# EAGLE design shield_final (EAGLE 9.6.2)
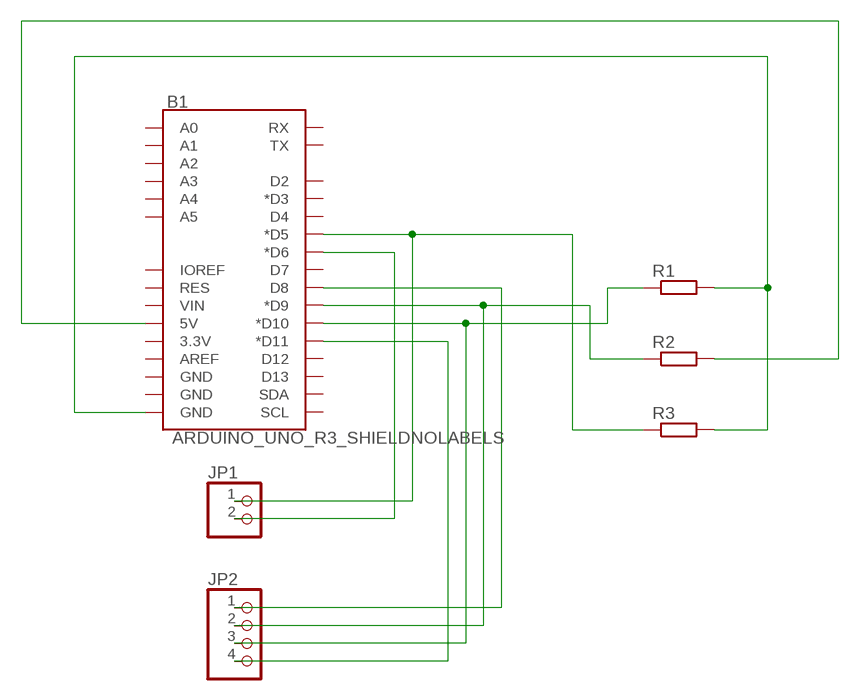
[diagram p0: schematic, sheet 1]

## Parts
B1  ARDUINO_UNO_R3_SHIELDNOLABELS  [UNO_R3_SHIELD_NOLABELS]
JP1  PINHD-1X2  [1X02]
JP2  PINHD-1X4  [1X04]
R1  R-EU_0207/10  [0207/10]
R2  R-EU_0207/10  [0207/10]
R3  R-EU_0207/10  [0207/10]

## Nets
N$1: B1.D8 JP2.1
N$2: B1.D9(*D9) JP2.2 R2.1
N$3: B1.D10(*D10) JP2.3 R1.1
N$4: B1.D11(*D11) JP2.4
N$5: B1.D5(*D5) JP1.1 R3.1
N$6: B1.D6(*D6) JP1.2
N$7: B1.GND@0(GND) R1.2 R3.2
N$8: B1.5V R2.2
Unconnected: B1.3.3V B1.A0 B1.A1 B1.A2 B1.A3 B1.A4 B1.A5 B1.AREF B1.D2 B1.D3(*D3) B1.D4 B1.D7 B1.D12 B1.D13 B1.GND@1(GND) B1.GND@2(GND) B1.IOREF B1.RES B1.RX B1.SCL B1.SDA B1.TX B1.VIN

## Library data of the parts
B1 = SparkFun-Boards:ARDUINO_UNO_R3_SHIELD: Arduino R3 Shield Footprint Shield form compatible with the Arduino Uno R3. SparkFun Products: MG2639 Cellular Shield <https://www.sparkfun.com/products/13120> MIDI Shield <https://www.sparkfun.com/products/12898> R3 Stackable Headers Kit <https://www.sparkfun.com/products/11417>
JP1 = pinhead:PINHD-1X2: PIN HEADER
JP2 = pinhead:PINHD-1X4: PIN HEADER
R1-R3 = rcl:R-EU_: RESISTOR, European symbol; SPICEPREFIX: R

## Board
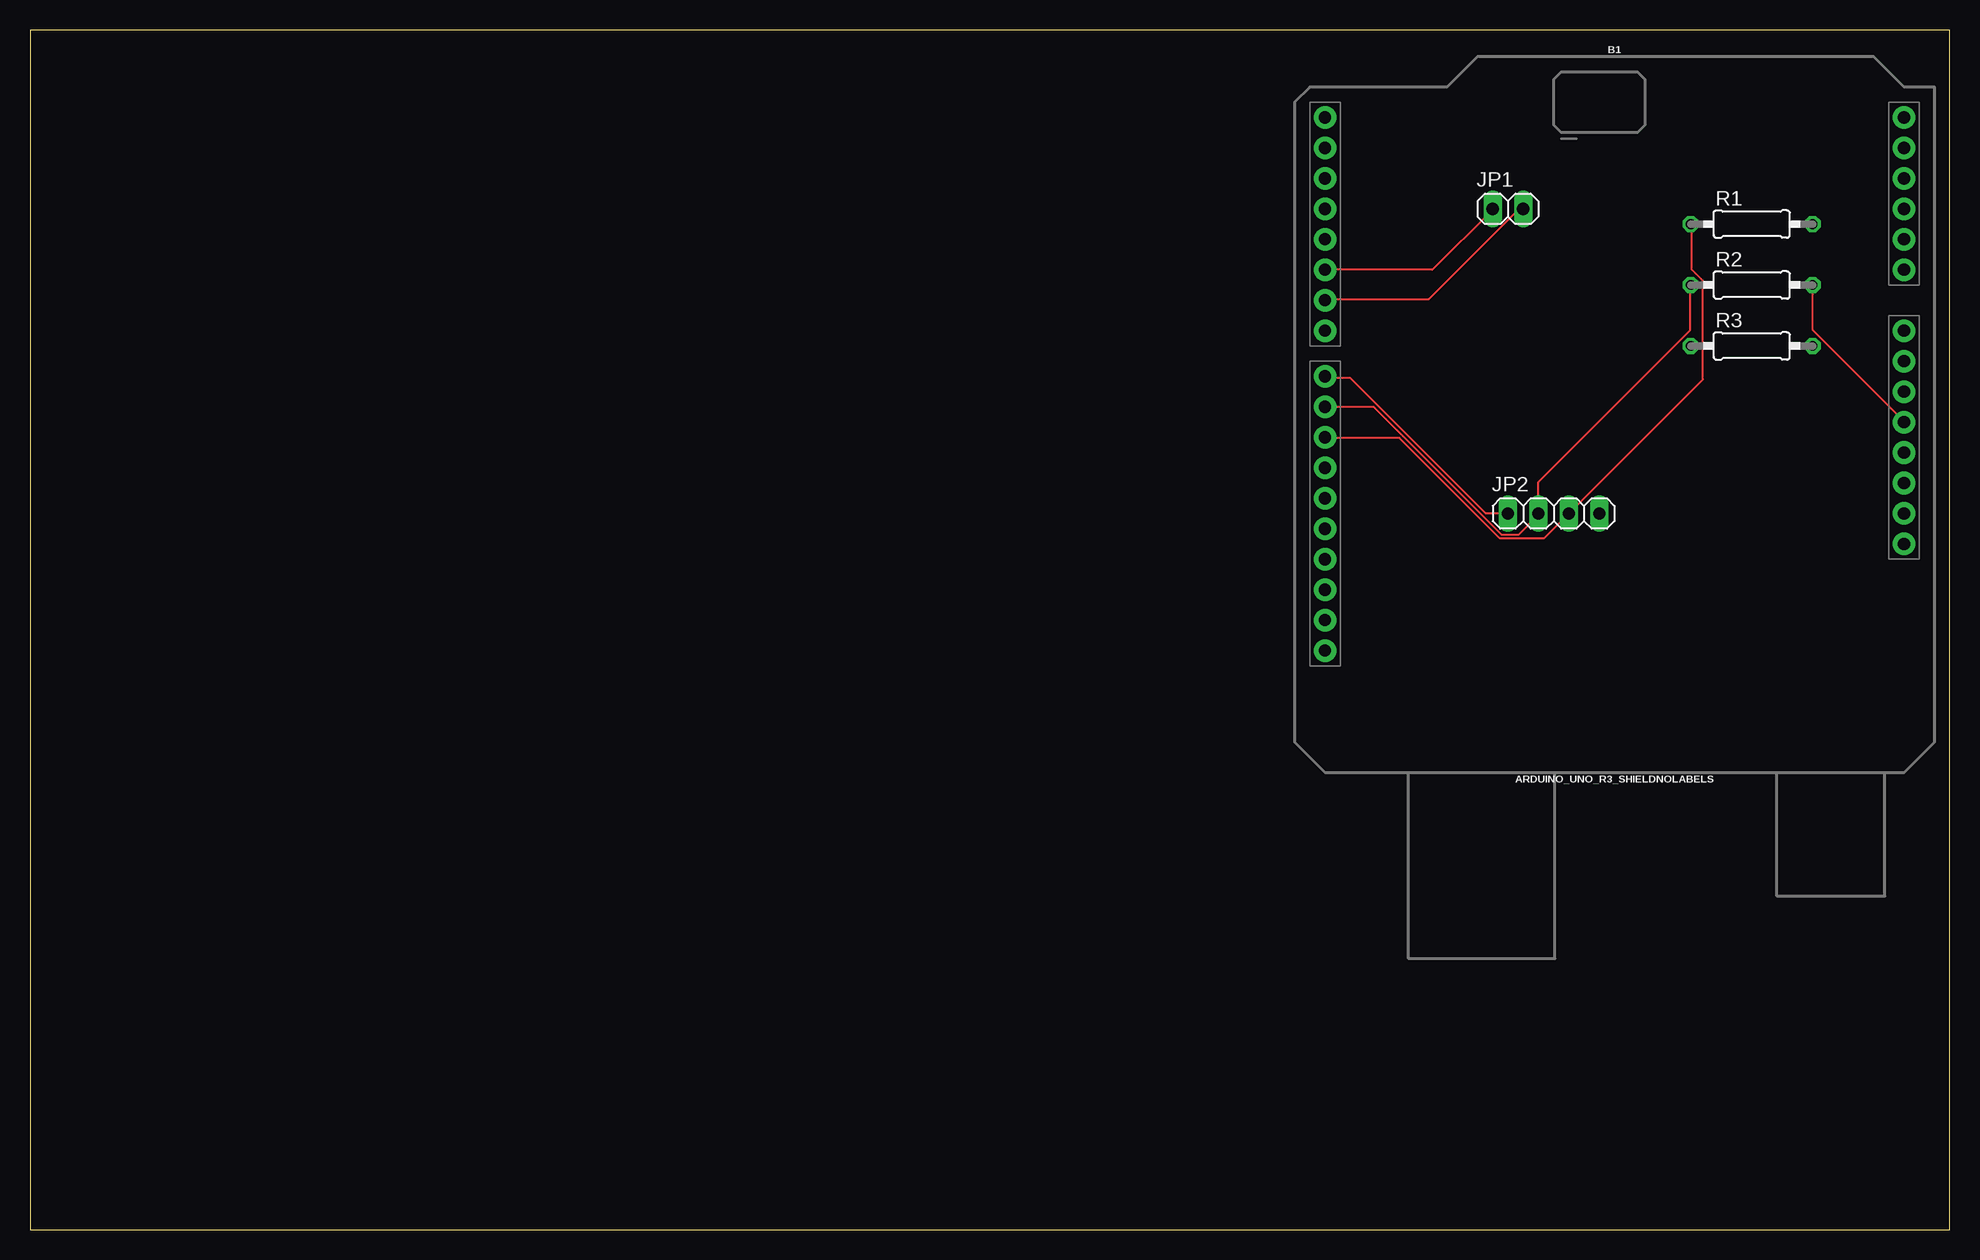
[diagram p1: board, top side]
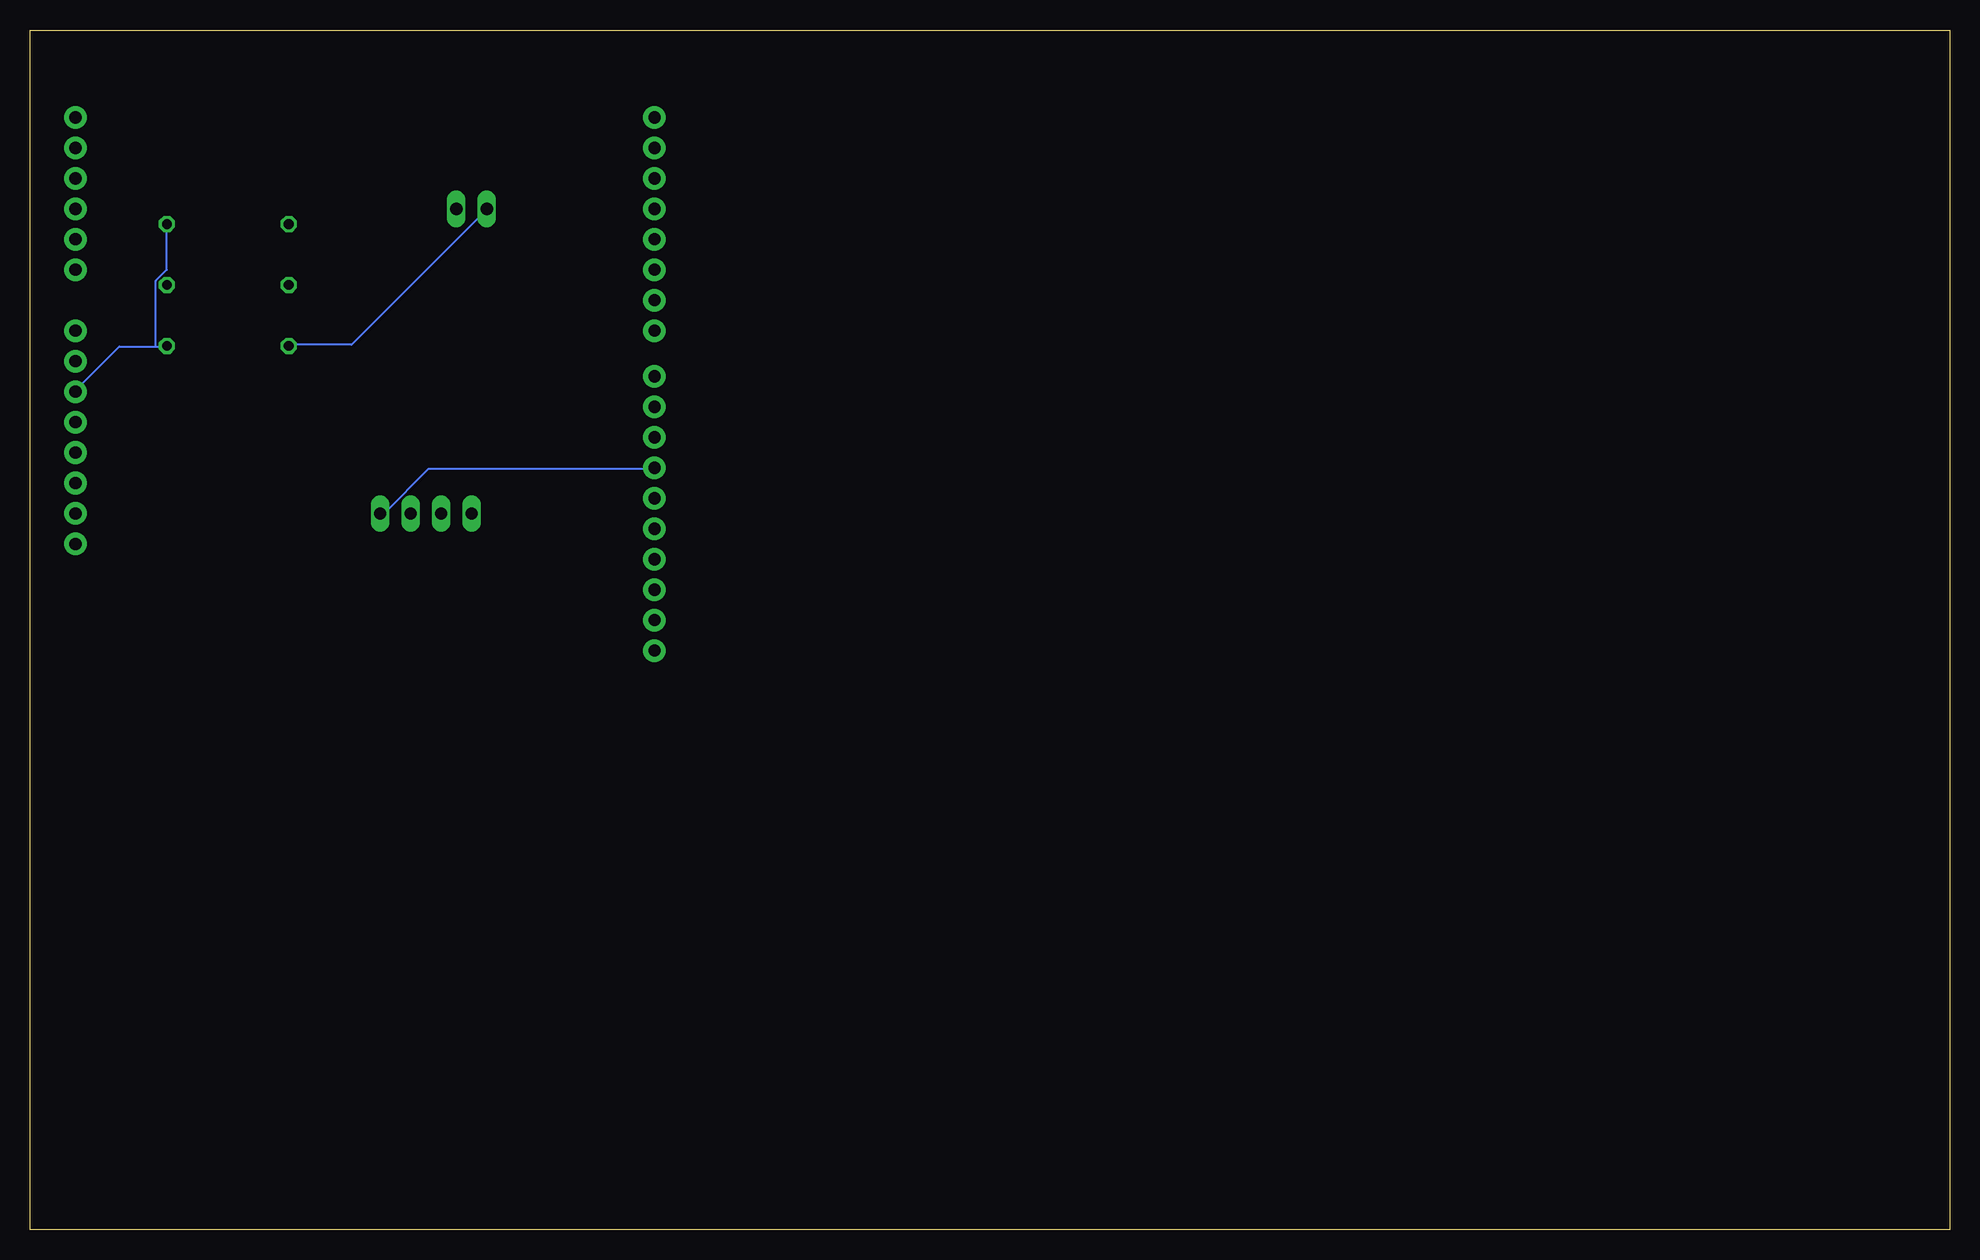
[diagram p2: board, bottom side, seen from below]

Size 160 x 100 mm. Coordinates in mm from the lower left corner, seen from the top.
Outline: 0,0 160,0 160,100 0,100 0,0
Copper layers (1*16): Top 0.035mm / dielectric 1.5mm / Bottom 0.035mm
Design rules "default": minimum track width 6mil, minimum drill 0.35mm, track to track 6mil, track to pad 6mil, pad to pad 6mil, via to via 6mil, smd to smd 6mil, copper to edge 40mil, drill to drill 6mil, minimum pad ring 10mil, minimum via ring 8mil, stop-mask expansion 4mil, vias tented up to drill 0mil, thermal gap 10mil

### Footprints (pad centres in the part's own frame; a part is rotated, then mirrored left to right if it is on the bottom)
UNO_R3_SHIELD_NOLABELS = drill 1.016 pad 1.88: 3.3V 24.13,-3.81; 5V 24.13,-1.27; A0 24.13,11.43; A1 24.13,13.97; A2 24.13,16.51; A3 24.13,19.05; A4 24.13,21.59; A5 24.13,24.13; AREF -24.13,-15.24; D2 -24.13,19.05; D3 -24.13,16.51; D4 -24.13,13.97; D5 -24.13,11.43; D6 -24.13,8.89; D7 -24.13,6.35; D8 -24.13,2.54; D9 -24.13,0; D10 -24.13,-2.54; D11 -24.13,-5.08; D12 -24.13,-7.62; D13 -24.13,-10.16; GND@0 24.13,1.27; GND@1 24.13,3.81; GND@2 -24.13,-12.7; IOREF 24.13,-8.89; NC 24.13,-11.43; RES 24.13,-6.35; RX -24.13,24.13; SCL -24.13,-20.32; SDA -24.13,-17.78; TX -24.13,21.59; VIN 24.13,6.35
1X02 = drill 1.016 long: 1 -1.27,0; 2 1.27,0
1X04 = drill 1.016 long: 1 -3.81,0; 2 -1.27,0; 3 1.27,0; 4 3.81,0
0207/10 = drill 0.813 octagon: 1 -5.08,0; 2 5.08,0

### Placement (x,y rotation side)
B1  132.08,68.58 0 top
JP1  123.19,85.09 0 top
JP2  127,59.69 0 top
R1  143.51,83.82 0 top
R2  143.51,78.74 0 top
R3  143.51,73.66 0 top

### Tracks (layer width: path | path; a pad name or v marks a point on that pad's centre or on a via)
N$1
  Top 0.152: JP2.1 123.14,59.74 121.31,59.74 110.03,71.02 108.05,71.02 B1.D8
N$2
  Top 0.152: R2.1 138.38,78.64 138.38,74.98 125.73,62.33 JP2.2 125.73,59.59 124.05,57.91 122.68,57.91 112.01,68.58 B1.D9
N$3
  Top 0.152: R1.1 138.53,83.82 138.53,80.01 139.45,79.1 139.45,70.87 JP2.3 126.19,57.61 122.53,57.61 114.15,65.99 108.05,65.99 B1.D10
N$4
  Bottom 0.152: JP2.4 130.76,59.74 130.45,59.74 126.8,63.4 108.05,63.4 B1.D11
N$5
  Top 0.152: B1.D5 116.89,80.01 121.92,85.04 JP1.1
  Bottom 0.152: R3.1 138.38,73.76 133.2,73.76 121.92,85.04 JP1.1
N$6
  Top 0.152: JP1.2 124.36,85.04 124.05,85.04 116.59,77.57 108.05,77.57 B1.D6
N$7
  Bottom 0.152: 149.5,73.61 152.55,73.61 156.21,69.95 B1.GND@0 | 149.5,73.61 148.59,73.61 R3.2 | R1.2 148.59,80.01 149.5,79.1 149.5,73.61
N$8
  Top 0.152: R2.2 148.59,74.98 156.21,67.36 B1.5V